# EAGLE design lis302 (EAGLE 7.3.0)
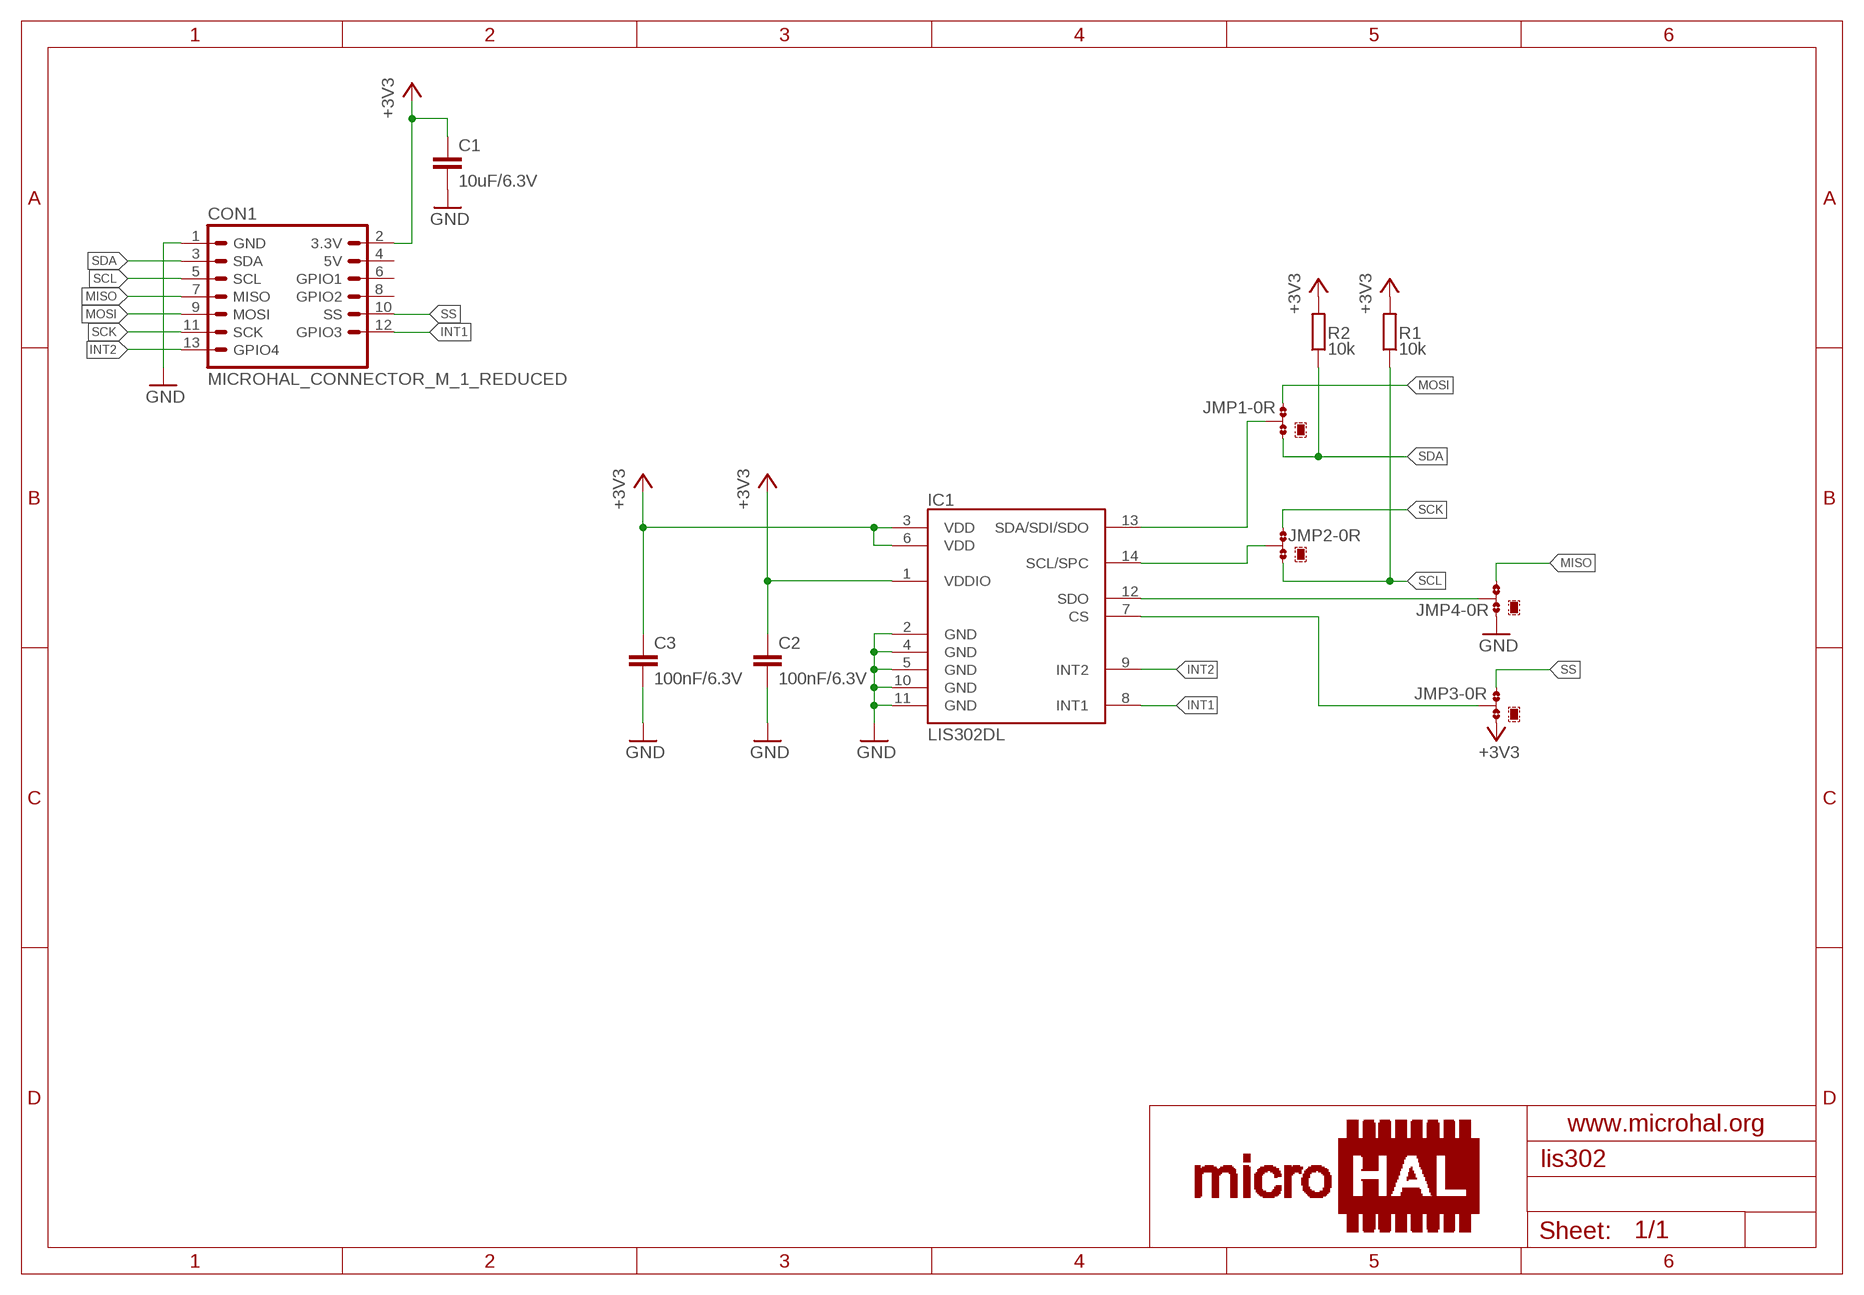
[diagram p0: schematic, sheet 1]

## Parts
C1  10uF/6.3V  C-EUC0805K  [C0805K]
C2  100nF/6.3V  C-EUC0603K  [C0603K]
C3  100nF/6.3V  C-EUC0603K  [C0603K]
CON1  MICROHAL_CONNECTOR_M_1_REDUCED  [MICROHAL_CONNECTOR_M_1_REDUCED_EDGE]
IC1  LIS302DL  [LGA14]
JMP1  0R-JUMPC  [C0R-JMP]
JMP2  0R-JUMPC  [C0R-JMP]
JMP3  0R-JUMPC  [C0R-JMP]
JMP4  0R-JUMPC  [C0R-JMP]
R1  10k  R-EU_R0603  [R0603]
R2  10k  R-EU_R0603  [R0603]

## Nets
+3V3: C1.1 C2.1 C3.1 CON1.2(3.3V) IC1.1(VDDIO) IC1.3(VDD) IC1.6(VDD) JMP3.1 R1.2 R2.2
GND: C1.2 C2.2 C3.2 CON1.1(GND) IC1.2(GND) IC1.4(GND) IC1.5(GND) IC1.10(GND) IC1.11(GND) JMP4.1
INT1: CON1.12(GPIO3) IC1.8(INT1)
INT2: CON1.13(GPIO4) IC1.9(INT2)
MISO: CON1.7(MISO) JMP4.3
MOSI: CON1.9(MOSI) JMP1.3
N$1: IC1.13(SDA/SDI/SDO) JMP1.2
N$4: IC1.14(SCL/SPC) JMP2.2
N$5: IC1.12(SDO) JMP4.2
N$6: IC1.7(CS) JMP3.2
SCK: CON1.11(SCK) JMP2.3
SCL: CON1.5(SCL) JMP2.1 R1.1
SDA: CON1.3(SDA) JMP1.1 R2.1
SS: CON1.10(SS) JMP3.3
Unconnected: CON1.4(5V) CON1.6(GPIO1) CON1.8(GPIO2)

## Library data of the parts
C1-C3 = rcl:C-EU: CAPACITOR, European symbol
CON1 = microhal-connector_v0.1:MICROHAL_CONNECTOR_M_1_REDUCED
IC1 = lis302:LIS302DL
JMP1-JMP4 = jump-0r-smd:0R-JUMP: SMD 0R 0805 Jumper
R1 R2 = rcl:R-EU_: RESISTOR, European symbol

## Board
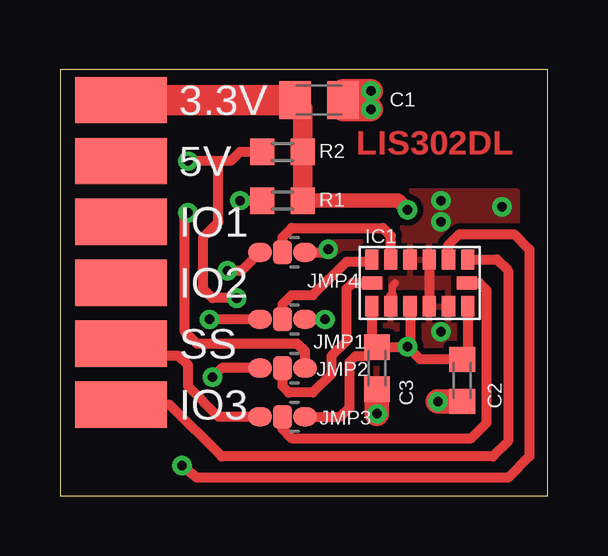
[diagram p1: board, top side]
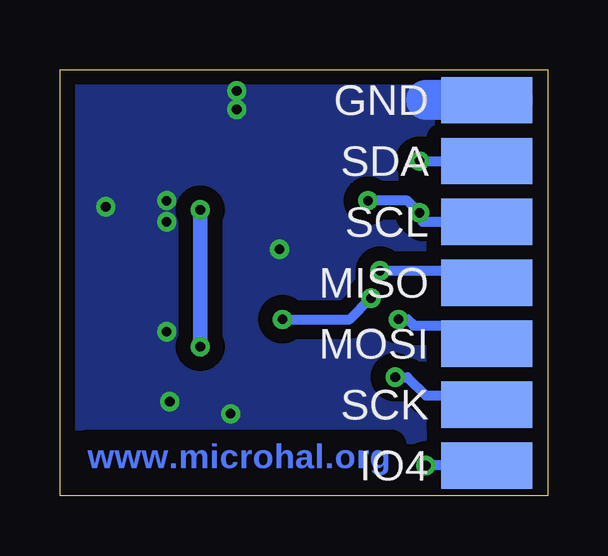
[diagram p2: board, bottom side, seen from below]

Size 20.32 x 17.78 mm. Coordinates in mm from the lower left corner, seen from the top.
Outline: 0,0 20.32,0 20.32,17.78 0,17.78 0,0
Copper layers (1*16): Top 0.035mm / dielectric 1.5mm / Bottom 0.035mm
Design rules "default *": minimum track width 10mil, minimum drill 14mil, track to track 8mil, track to pad 8mil, pad to pad 8mil, via to via 8mil, smd to smd 4mil, copper to edge 20mil, drill to drill 8mil, minimum pad ring 10mil, minimum via ring 8mil, stop-mask expansion 4mil, vias tented up to drill 16mil, thermal gap 10mil

### Footprints (pad centres in the part's own frame; a part is rotated, then mirrored left to right if it is on the bottom)
C0805K = smd 1.3 x 1.6: 1 -1,0; 2 1,0
C0603K = smd 1.05 x 1.08: 1 -0.875,0; 2 0.875,0
MICROHAL_CONNECTOR_M_1_REDUCED_EDGE = smd 1.93 x 3.81 bottom: 1 -7.62,0; 3 -5.08,0; 5 -2.54,0; 7 0,0; 9 2.54,0; 11 5.08,0; 13 7.62,0 | smd 1.93 x 3.81: 2 -7.62,0; 4 -5.08,0; 6 -2.54,0; 8 0,0; 10 2.54,0; 12 5.08,0
LGA14 = smd 0.85 x 0.55: 1 -0.975,2; 2 -0.975,1.2; 3 -0.975,0.4; 4 -0.975,-0.4; 5 -0.975,-1.2; 6 -0.975,-2; 8 0.975,-2; 9 0.975,-1.2; 10 0.975,-0.4; 11 0.975,0.4; 12 0.975,1.2; 13 0.975,2 | smd 0.55 x 0.85: 7 0,-1.975; 14 0,1.975
C0R-JMP = smd 0.8 x 1: 1 0,0.938; 3 0,-0.938 | smd 1 x 0.8: 2 0,0
R0603 = smd 1 x 1.1: 1 -0.85,0; 2 0.85,0

### Placement (x,y rotation side)
C1  10.79,16.51 0 top
C2  16.76,4.83 270 top
C3  13.21,5.33 270 top
CON1  2.54,8.89 270 top
IC1  14.99,8.89 90 top
JMP1  9.27,7.37 270 top
JMP2  9.27,5.33 270 top
JMP3  9.27,3.3 270 top
JMP4  9.27,10.16 270 top
R1  9.27,12.32 0 top
R2  9.27,14.35 0 top

### Tracks (layer width: path | path; a pad name or v marks a point on that pad's centre or on a via)
+3V3  (via drill 0.4)
  Top 0.406: IC1.6 16.99,5.8 C2.1 15,5.7 v14.48,6.22 14.48,6.08 14.61,6.21 | IC1.1 12.99,6.43 C3.1 | C3.1 12.84,5.84 12.32,5.84 12.06,5.59 12.06,3.68 11.68,3.3 JMP3.1 | C3.1 14.61,6.21 | IC1.3 14.59,6.23 14.61,6.21
  Top 0.61: R1.2 14.1,12.32 v14.48,11.94
  Top 0.813: R1.2 R2.2 10.12,16.18 C1.1
  Top 1.27: CON1.2 C1.1
  Bottom 0.61: v14.48,11.94 v14.48,6.22
GND  (via drill 0.4)
  Top 0.305: 13.84,8.38 13.84,8.76 13.97,8.89
  Top 0.406: IC1.10 IC1.4 | IC1.2 13.79,8.32 13.84,8.38 | JMP4.1 11.05,10.16 v11.18,10.29
  Top 1.016: v13.21,3.43 C3.2 | v15.75,3.94 C2.2 | v12.95,16.89 11.79,16.89 C1.2 | v12.95,16.13 11.81,16.13 11.81,16.64
  Bottom 1.676: CON1.1 5.08,16.51
  other vias: 15.88,11.43 15.88,12.32 18.41,12.06 15.88,6.86
  pour Bottom (isolate 0.61): 0,17.78 20.32,17.78 20.32,0 0,0
  pour Top (isolate 0.254): 11.43,11.43 11.43,5.08 19.05,5.08 19.05,12.7 11.43,12.7
INT1
  Top 0.406: CON1.12 4.57,3.81 6.73,1.65 18.03,1.65 18.67,2.29 18.67,9.4 18.2,9.87 IC1.8
INT2  (via drill 0.4)
  Top 0.406: IC1.9 16.19,10.47 16.64,10.92 18.92,10.92 19.56,10.29 19.56,1.65 18.67,0.76 5.71,0.76 v5.08,1.27
  Bottom 0.406: CON1.13 v5.08,1.27
MISO  (via drill 0.4)
  Top 0.406: v6.99,9.4 7.57,9.4 JMP4.3
  Bottom 0.406: v6.99,9.4 3.17,9.4 CON1.7
MOSI  (via drill 0.4)
  Top 0.406: JMP1.3 v6.22,7.37
  Bottom 0.406: v6.22,7.37 5.84,7.37 5.59,7.11 3.3,7.11 CON1.9
N$1
  Top 0.406: JMP1.2 9.27,8 9.65,8.38 10.54,8.38 11.94,9.78 12.9,9.78 IC1.13
N$4
  Top 0.406: IC1.14 12.19,8.89 11.94,8.64 11.94,6.48 11.3,5.84 11.3,5.08 10.54,4.32 9.53,4.32 9.27,4.57 JMP2.2
N$5
  Top 0.406: JMP4.2 9.27,10.79 9.65,11.18 13.46,11.18 13.79,10.85 IC1.12
N$6
  Top 0.406: JMP3.2 9.27,2.79 9.65,2.41 17.14,2.41 17.78,3.05 17.78,8.58 17.47,8.89 IC1.7
SCK  (via drill 0.4)
  Top 0.406: JMP2.3 6.73,5.33 v6.35,4.95
  Bottom 0.406: v6.35,4.95 5.84,4.95 5.08,4.19 2.92,4.19 CON1.11
SCL  (via drill 0.4)
  Top 0.406: JMP2.1 10.21,6.05 9.91,6.35 5.71,6.35 5.21,6.86 5.21,11.68 v5.33,11.81 | 8.29,12.19 R1.1 v7.49,12.32
  Bottom 0.406: CON1.5 5.21,11.43 v5.33,11.81 5.84,12.32 v7.49,12.32
SDA  (via drill 0.4)
  Top 0.406: JMP1.1 v11.05,7.37 | v7.37,8.26 6.35,8.26 5.97,8.64 5.97,10.79 6.6,11.43 6.6,13.97 | R2.1 7.49,14.35 7.11,13.97 6.6,13.97 | 6.6,13.97 v5.33,13.97
  Bottom 0.406: v11.05,7.37 8.26,7.37 v7.37,8.26 | v5.33,13.97 CON1.3
SS
  Top 0.406: JMP3.3 6.6,3.3 5.33,4.57 5.33,5.46 4.95,5.84 3.05,5.84 CON1.10

### Text on the board
Top: LIS302DL
Bottom: www.microhal.org
tStop: LIS302DL
bStop: www.microhal.org